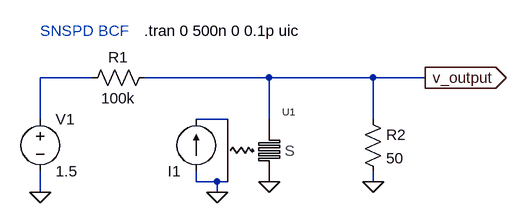
[diagram p0: schematic snspd.asc]
snspd.asc, the LTspice schematic file:
Version 4
SHEET 1 880 680
WIRE -320 -656 -400 -656
WIRE -48 -656 -240 -656
WIRE 112 -656 -48 -656
WIRE 192 -656 112 -656
WIRE -400 -592 -400 -656
WIRE -112 -592 -160 -592
WIRE -48 -592 -48 -656
WIRE 112 -592 112 -656
WIRE -160 -496 -160 -512
WIRE -128 -496 -160 -496
WIRE -112 -496 -128 -496
WIRE 112 -496 112 -512
WIRE -400 -480 -400 -512
WIRE -128 -480 -128 -496
FLAG 112 -496 0
FLAG -48 -496 0
FLAG -128 -480 0
FLAG -400 -480 0
FLAG 192 -656 v_output
IOPIN 192 -656 Out
SYMBOL snspdWithPhotonPort -48 -544 R0
SYMATTR InstName U1
SYMATTR Value Lind=100n
SYMBOL res 96 -608 R0
SYMATTR InstName R2
SYMATTR Value 50
SYMBOL current -160 -512 R180
WINDOW 3 -212 -59 Invisible 2
WINDOW 123 0 0 Left 2
WINDOW 39 0 0 Left 2
SYMATTR Value PWL file=C:\Users\zewen\Downloads\SNSPDsSim\outputPy\snspd_data.txt
SYMATTR InstName I1
SYMBOL voltage -400 -608 R0
WINDOW 123 0 0 Left 2
SYMATTR InstName V1
SYMATTR Value 1.5
SYMATTR SpiceLine Rser=0
SYMBOL res -224 -672 R90
WINDOW 0 0 56 VBottom 2
WINDOW 3 32 56 VTop 2
SYMATTR InstName R1
SYMATTR Value 100k
TEXT -240 -728 Left 2 !.tran 0 500n 0 0.1p uic
TEXT -400 -728 Left 2 ;SNSPD BCF

The netlist it stands for:
* snspd.asc
XU1 N002 0 v_output 0 nanowireBCF Lind=100n  ; pins gate-in photon-out ? ?
R2 v_output 0 50
I1 0 N002 PWL file=C:\Users\zewen\Downloads\SNSPDsSim\outputPy\snspd_data.txt
V1 N001 0 1.5 Rser=0
R1 v_output N001 100k
.tran 0 500n 0 0.1p uic
* SNSPD BCF
.lib snspd.lib
.backanno
.end